# EAGLE design lora (EAGLE 6.5.0)
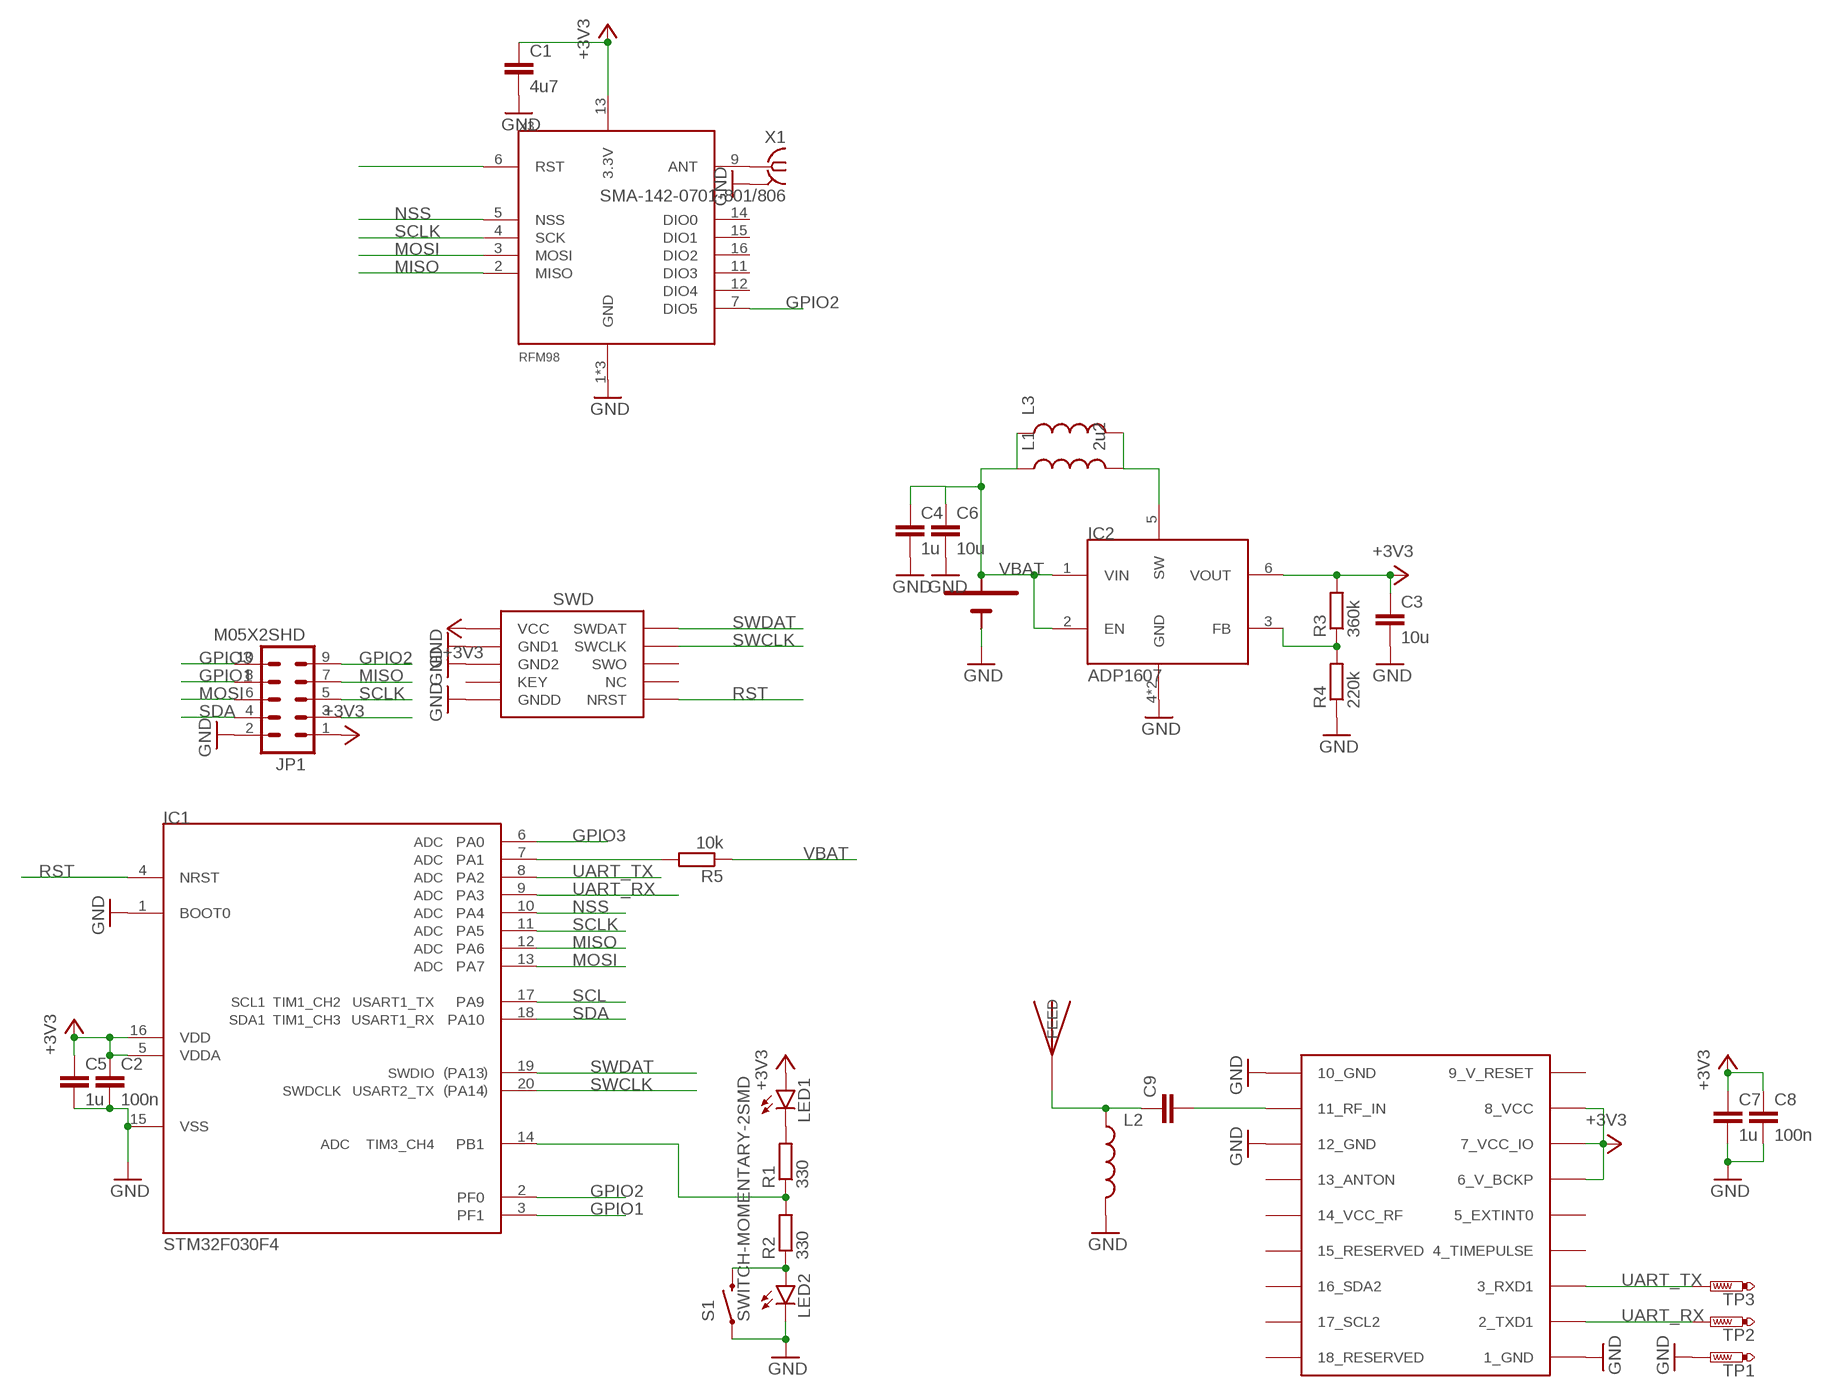
[diagram p0: schematic, sheet 1]

## Parts
C1  4u7  C-EUC0603  [C0603]
C2  100n  C-EUC0603  [C0603]
C3  10u  C-EUC0805  [C0805]
C4  1u  C-EUC0603  [C0603]
C5  1u  C-EUC0603  [C0603]
C6  10u  C-EUC0805  [C0805]
C7  1u  C-EUC0603  [C0603]
C8  100n  C-EUC0603  [C0603]
C9  C-EUC0603  [C0603]
IC1  STM32F030F4  [TSSOP20]
IC2  ADP1607  [LFCSP6]
J1  SWD_PTH_SHROUD  [SWD_PTH_SHROUD]
JP1  M05X2SHD  [2X5-SHROUDED]
L1  2u2  INDUCTOR0805  [0805]
L2  INDUCTOR0603  [0603]
L3  INDUCTOR1210  [1210]
LED1  LED0603  [LED-0603]
LED2  LED0603  [LED-0603]
R1  330  R-EU_R0603  [R0603]
R2  330  R-EU_R0603  [R0603]
R3  360k  R-EU_R0603  [R0603]
R4  220k  R-EU_R0603  [R0603]
R5  10k  R-EU_R0603  [R0603]
S1  SWITCH-MOMENTARY-2SMD  [TACTILE_SWITCH_SMD]
TP1  PTR1B1,27  [B1,27]
TP2  PTR1B1,27  [B1,27]
TP3  PTR1B1,27  [B1,27]
U$5  JTI_ANTENNA-1575AT43A40  [JTI_ANTENNA-1575AT43A40]
U$6  KEYSTONE-53  [KEYSTONE53]
X1  SMA-142-0701-801/806  [J502-ND-142-0701-801/806]
X2  UBLOX_MAX  [UBLOX_MAX]
X3  RFM98  [RFM97]

## Nets
+3V3: C1.1 C2.1 C3.1 C5.1 C7.1 C8.1 IC1.5(VDDA) IC1.16(VDD) IC2.6(VOUT) J1.1(VCC) JP1.1 LED1.A R3.2 X2.6_V_BCKP X2.7_VCC_IO X2.8_VCC X3.13(3.3V)
GND: C1.2 C2.2 C3.2 C4.2 C5.2 C6.2 C7.2 C8.2 IC1.1(BOOT0) IC1.15(VSS) IC2.4(GND) IC2.EP(GND) J1.3(GND1) J1.5(GND2) J1.9(GNDD) JP1.2 L2.2 LED2.C R4.1 S1.1 TP1.TP U$6.N1(-) U$6.N2(-) X1.G@1 X1.G@2 X1.G@3 X1.G@4 X2.1_GND X2.10_GND X2.12_GND X3.1(GND) X3.8(GND) X3.10(GND)
GPIO1: IC1.3(PF1) JP1.8
GPIO2: IC1.2(PF0) JP1.9 X3.7(DIO5)
GPIO3: IC1.6(PA0) JP1.10
MISO: IC1.12(PA6) JP1.7 X3.2(MISO)
MOSI: IC1.13(PA7) JP1.6 X3.3(MOSI)
N$1: C9.2 X2.11_RF_IN
N$2: X1.1 X3.9(ANT)
N$3: IC2.5(SW) L1.2 L3.2
N$4: C9.1 L2.1 U$5.FEED
N$5: LED2.A R2.1 S1.3
N$6: IC2.3(FB) R3.1 R4.2
N$7: LED1.C R1.2
N$8: IC1.14(PB1) R1.1 R2.2
N$9: IC1.7(PA1) R5.2
N$10: X3.6(RST)
NSS: IC1.10(PA4) X3.5(NSS)
RST: IC1.4(NRST) J1.10(NRST)
SCL: IC1.17(PA9) JP1.3
SCLK: IC1.11(PA5) JP1.5 X3.4(SCK)
SDA: IC1.18(PA10) JP1.4
SWCLK: IC1.20(PA14) J1.4(SWCLK)
SWDAT: IC1.19(PA13) J1.2(SWDAT)
UART_RX: IC1.9(PA3) TP2.TP X2.2_TXD1
UART_TX: IC1.8(PA2) TP3.TP X2.3_RXD1
VBAT: C4.1 C6.1 IC2.1(VIN) IC2.2(EN) L1.1 L3.1 R5.1 U$6.P1(+) U$6.P2(+)
Unconnected: J1.6(SWO) J1.7(KEY) J1.8(NC) X2.4_TIMEPULSE X2.5_EXTINT0 X2.13_ANTON X2.14_VCC_RF X2.15_RESERVED X2.16_SDA2 X2.17_SCL2 X2.18_RESERVED X3.11(DIO3) X3.12(DIO4) X3.14(DIO0) X3.15(DIO1) X3.16(DIO2)

## Power pins joined to a net without a drawn wire
9_V_RESET: X2.9_V_RESET

## Library data of the parts
C1-C9 = rcl:C-EU: CAPACITOR, European symbol
IC1 = dtb:STM32F030F4
IC2 = Mine:ADP1607
J1 = dtb:SWD_PTH_SHROUD
JP1 = SparkFun-Connectors:M05X2: Header 5x2 Standard 10-pin dual row 0.1" header. Commonly used with AVR-ISP. Use with Spark Fun Electronics SKU: PRT-00778
L1-L3 = SparkFun-Passives:INDUCTOR: Inductors Basic Inductor/Choke - 0603 and 1206. Footprints are not proven and vary greatly between part numbers. SRN6045- 33uH, 20% 1.4A SDR0403-560KL - 56uH, 10%, 500mA RMS/740mA peak
LED1 LED2 = SparkFun-LED:LED: LEDs Standard schematic elements and footprints for 5mm, 3mm, 1206, and 0603 sized LEDs. 5mm - Spark Fun Electronics SKU : COM-00529 (and others)
R1-R5 = rcl:R-EU_: RESISTOR, European symbol
S1 = Mine:SWITCH-MOMENTARY-2: Various NO switches- pushbuttons, reed, etc
TP1-TP3 = testpad:PTR1: TEST PIN
U$5 = Ava:JTI_ANTENNA-1575AT43A40
U$6 = Mine:KEYSTONE-53
X1 = con-coax:SMA-: SMA 50 Ohm End Launch Jack Receptacle - Round Contact Johnson Components Source: www.johnsoncomponents.com .. J502-ND.pdf; MF: JOHNSON COMPONENTS; MPN: 142-0701-801; OC_FARNELL: 1608592; OC_NEWARK: 90F2624
X2 = Ava:UBLOX_MAX: UBLOX MAX
X3 = Mine:RFM98

## Board
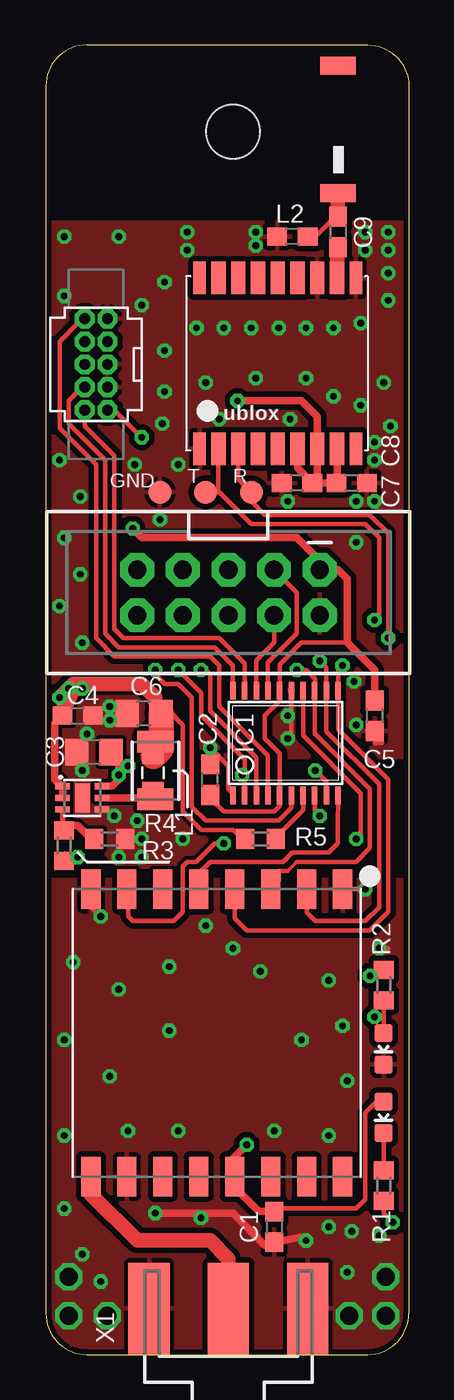
[diagram p1: board, top side]
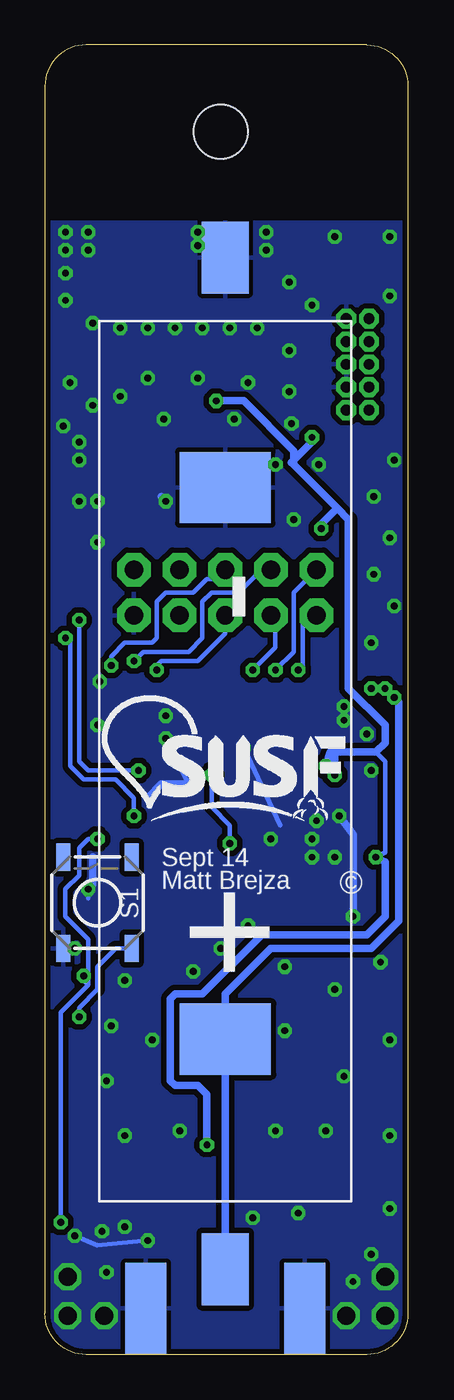
[diagram p2: board, bottom side, seen from below]

Size 20.19 x 72.9 mm. Coordinates in mm from the lower left corner, seen from the top.
Outline: 2.29,0 17.91,0 arc90 20.19,2.29 20.19,70.61 arc90 17.91,72.9 2.29,72.9 arc90 0,70.61 0,2.29 arc90 2.29,0
Copper layers (1*16): Top 0.035mm / dielectric 1.5mm / Bottom 0.035mm
Design rules "default *": minimum track width 8mil, minimum drill 15mil, track to track 8mil, track to pad 8mil, pad to pad 6mil, via to via 8mil, smd to smd 0mil, copper to edge 10mil, drill to drill 8mil, minimum pad ring 10mil, minimum via ring 8mil, stop-mask expansion 4mil, vias tented up to drill 15mil, thermal gap 10mil
Holes 3 mm at 10.41,68.07

### Footprints (pad centres in the part's own frame; a part is rotated, then mirrored left to right if it is on the bottom)
C0603 = smd 1.1 x 1: 1 -0.85,0; 2 0.85,0
C0805 = smd 1.3 x 1.5: 1 -0.95,0; 2 0.95,0
TSSOP20 = smd 0.305 x 0.991: 1 -2.925,-2.918; 2 -2.275,-2.918; 3 -1.625,-2.918; 4 -0.975,-2.918; 5 -0.325,-2.918; 6 0.325,-2.918; 7 0.975,-2.918; 8 1.625,-2.918; 9 2.275,-2.918; 10 2.925,-2.918; 11 2.925,2.918; 12 2.275,2.918; 13 1.625,2.918; 14 0.975,2.918; 15 0.325,2.918; 16 -0.325,2.918; 17 -0.975,2.918; 18 -1.625,2.918; 19 -2.275,2.918; 20 -2.925,2.918
LFCSP6 = smd 0.35 x 0.8: 1 -0.65,-1.1; 2 0,-1.1; 3 0.65,-1.1; 4 0.65,1.1; 5 0,1.1; 6 -0.65,1.1 | smd 1.6 x 0.8: EP 0,0
SWD_PTH_SHROUD = drill 0.6 octagon: 1 -2.54,-0.635; 2 -2.54,0.635; 3 -1.27,-0.635; 4 -1.27,0.635; 5 0,-0.635; 6 0,0.635; 7 1.27,-0.635; 8 1.27,0.635; 9 2.54,-0.635; 10 2.54,0.635
2X5-SHROUDED = drill 1.016 pad 1.88 octagon: 1 -1.27,5.08; 2 1.27,5.08; 3 -1.27,2.54; 4 1.27,2.54; 5 -1.27,0; 6 1.27,0; 7 -1.27,-2.54; 8 1.27,-2.54; 9 -1.27,-5.08; 10 1.27,-5.08
0805 = smd 0.8 x 1.2: 1 -0.9,0; 2 0.9,0
0603 = smd 1.1 x 1: 1 -0.85,0; 2 0.85,0
1210 = smd 1.2 x 2: 1 -1.6,0; 2 1.6,0
LED-0603 = smd 1 x 1: A 0,-0.877; C 0,0.877
R0603 = smd 1 x 1.1: 1 -0.85,0; 2 0.85,0
TACTILE_SWITCH_SMD = smd 1.524 x 0.762: 1 -2.54,1.905; 2 2.54,1.905; 3 -2.54,-1.905; 4 2.54,-1.905
B1,27 = smd 1.27 x 1.27: TP 0,0
JTI_ANTENNA-1575AT43A40 = smd 1 x 2: FEED -3.175,0; NC 3.925,0
KEYSTONE53 = smd 3.96 x 5.08: N1 14.73,0; P2 -15.97,0 | smd 4 x 2.6: N2 27.53,0; P1 -28.77,0
J502-ND-142-0701-801/806 = smd 5.08 x 2.286: 1 2.565,0; G@1 2.565,4.42; G@2 2.565,-4.42 | smd 5.08 x 2.286 bottom: G@3 2.565,4.42; G@4 2.565,-4.42
UBLOX_MAX = smd 1.8 x 0.7: 1_GND 4.95,-4.4; 9_V_RESET 4.95,4.3; 10_GND -4.55,4.3; 18_RESERVED -4.55,-4.4 | smd 1.8 x 0.8: 2_TXD1 4.95,-3.35; 3_RXD1 4.95,-2.25; 4_TIMEPULSE 4.95,-1.15; 5_EXTINT0 4.95,-0.05; 6_V_BCKP 4.95,1.05; 7_VCC_IO 4.95,2.15; 8_VCC 4.95,3.25; 11_RF_IN -4.55,3.25; 12_GND -4.55,2.15; 13_ANTON -4.55,1.05; 14_VCC_RF -4.55,-0.05; 15_RESERVED -4.55,-1.15; 16_SDA2 -4.55,-2.25; 17_SCL2 -4.55,-3.35
RFM97 = smd 2.184 x 1.067: 1 0,0; 2 0,-2; 3 0,-4; 4 0,-6; 5 0,-8; 6 0,-10; 7 0,-12; 8 0,-14; 9 16,-14; 10 16,-12; 11 16,-10; 12 16,-8; 13 16,-6; 14 16,-4; 15 16,-2; 16 16,0

### Placement (x,y rotation side)
C1  12.7,7.11 270 top
C2  9.14,32 90 top
C3  2.67,33.53 180 top
C4  1.78,35.56 0 top
C5  18.29,35.56 270 top
C6  5.46,35.69 180 top
C7  13.97,48.51 180 top
C8  17.02,48.51 0 top
C9  16.26,62.48 270 top
IC1  13.34,34.04 0 top
IC2  2.03,30.99 270 top
J1  2.79,55.12 90 top
JP1  10.16,42.42 270 top
L1  5.97,32.38 270 top
L2  13.72,62.23 180 top
L3  6.1,32.51 270 top
LED1  18.8,13.21 180 top
LED2  18.8,17.02 180 top
R1  18.8,9.4 90 top
R2  18.8,20.57 90 top
R3  1.02,28.32 270 top
R4  3.56,28.7 180 top
R5  11.94,28.7 0 top
S1  17.27,25.15 90 bottom
TP1  6.35,48.01 0 top
TP2  8.89,48.01 0 top
TP3  11.43,48.01 0 top
U$1  [SUSF-XSM]  17.02,29.72 0 bottom
U$5  16.26,67.82 90 top
U$6  10.16,33.53 90 bottom
X1  10.16,0 90 top
X2  12.95,55.37 270 top
X3  16.51,25.91 270 top

### Tracks (layer width: path | path; a pad name or v marks a point on that pad's centre or on a via)
+3V3  (via drill 0.38)
  Top 0.254: 16.17,50.39 X2.8_VCC | v5.33,51.05 3.81,52.58 J1.1 | C3.1 4.12,32.96 | R3.2 1.05,27.9 v1.78,27.69 | C5.1 18.45,36.41 | 16.76,39.62 14.22,39.62 13.01,38.41 IC1.16 13.01,36.38 12.19,35.56 12.19,34.29 13.01,33.47 IC1.5 13.01,30.54 12.7,30.23 9.91,30.23 9.65,30.48 9.4,30.65 C2.1 | LED1.A 18.4,14.08 17.78,13.46 17.78,8.64 17.27,8.13 12.87,8.13 C1.1
  Top 0.406: IC2.6 3.7,31.64 4.06,32 v4.06,32.26 4.06,33.47 C3.1 | v4.83,45.97 5.33,45.47 13.97,45.47 15.24,44.2 JP1.1 16.26,43.69 16.76,43.18 16.76,39.62 18.29,38.1 C5.1 | C1.1 11.85,7.96 10.67,9.14 10.67,9.75 X3.13 10.41,10 10.41,10.92 v11.18,11.68 | C8.1 16.2,48.55 X2.8_VCC 16.2,48.97 15.75,48.51 C7.1 | v10.67,53.09 14.22,53.09 15.1,52.21 X2.7_VCC_IO 15.1,48.8 C7.1 | X2.6_V_BCKP 14,49.33 C7.1
  Bottom 0.254: 1.78,33.53 1.27,33.02 1.27,27.94 v1.78,27.69
  Bottom 0.406: 3.94,47.12 3.3,46.48 3.3,37.08 1.27,35.05 1.27,34.04 1.78,33.53 4.06,33.53 | 3.94,47.12 6.35,49.53 | v5.33,51.05 5.33,50.8 6.48,49.66 6.35,49.53 | v4.83,45.97 4.83,46.23 3.94,47.12 | 4.06,33.53 4.32,33.53 v4.57,32.77 | v10.67,53.09 9.14,53.09 6.35,50.29 6.35,49.53 | v11.18,11.68 11.18,14.48 11.68,14.99 12.95,14.99 13.21,15.24 13.21,19.81 12.95,20.07 11.43,20.07 8.13,23.37 2.29,23.37 1.27,24.38 1.27,27.43 v1.78,27.69 | v4.06,32.26 4.06,33.53
GND  (via drill 0.38, 1)
  Top 0.254: C5.2 18.71,34.04 18.29,34.04 | X3.1 v17.78,25.91 | C2.2 v9.14,33.78 10.16,32.77 10.16,31.5 10.41,31.25 IC1.1 | X3.8 2.51,24.92 v3.05,24.38 | IC1.15 13.66,34.35 v13.46,34.29 | v18.54,22.61 19.05,22.61
  Top 0.406: 9.06,32.51 C2.2 | v14.48,6.35 14.14,6.52 C1.2 12.19,6.1 10.41,7.87 v6.1,7.87 | C7.2 13.12,48.68 | 4.57,9.4 4.57,9.85 X3.10
  Bottom 0.254: v17.78,25.91 17.78,25.4 | 12.19,31.75 v13.46,34.29 | 18.29,6.6 v18.54,6.6 17.27,6.1 v14.48,6.35 | 7.11,29.46 v9.14,33.78 | S1.1 v18.54,22.61
  Bottom 0.406: 12.19,31.75 13.72,31.75 14.48,30.99 | v17.78,25.91 17.53,26.16 17.53,27.69 | U$6.N2 10.16,59.69 | v13.46,47.5 13.72,47.75 | v3.05,24.38 3.05,28.96 v3.81,29.97
  other vias: 17.27,35.05 2.03,32.51 5.08,29.72 5.33,28.7 5.33,27.69 3.56,35.31 2.29,34.54 3.56,36.07 15.75,12.19 13.46,35.56 9.91,57.15 17.53,57.4 17.53,52.83 9.65,52.07 11.68,61.72 11.68,62.48 18.29,47.5 18.29,49.78 18.29,50.8 17.27,47.5 19.18,51.69 8.38,57.15 11.43,57.15 12.95,57.15 14.48,57.15 16,57.15 17.78,62.48 17.78,61.47 19.05,62.48 19.05,61.47 19.05,60.2 19.05,58.67 7.87,62.48 7.87,61.47 6.6,55.88 6.6,53.59 6.6,59.69 8.89,54.1 16,53.34 7.37,49.53 6.35,46.48 14.48,54.36 11.68,54.36 18.8,54.1 17.27,45.21 0.76,49.78 1.91,47.75 1.02,45.47 1.91,43.43 0.76,41.66 2.03,39.62 4.06,62.23 1.02,62.23 10.41,22.61 8.89,23.88 1.52,21.84 6.86,21.59 1.02,12.19 4.57,12.45 7.37,12.45 12.7,12.45 16.76,15.24 16.51,18.29 15.75,20.83 11.94,21.34 14.22,17.53 6.86,18.03 1.02,17.53 3.56,15.49 4.06,20.32 2.03,5.59 8.64,7.62 15.75,7.11 17.02,6.86 1.02,8.13 16.76,4.57 13.59,52.07 6.48,51.82 4.95,49.53 3.43,2.16 1.27,2.16 16.89,2.16 18.92,2.16 3.05,4.06 1.27,4.32 18.92,4.32 17.14,37.46 1.02,58.93 5.33,58.42 7.62,28.7 4.06,27.69
  pour Bottom (isolate 0.305): 0,62.99 21.84,62.99 21.84,0.25 -2.03,0.25 -2.03,12.45
  pour Top (isolate 0.305): -0.51,62.99 22.1,62.99 22.1,33.27 -0.76,33.27 -0.76,54.86
  pour Top (no thermals): 1.52,37.08 4.57,37.08 5.59,36.07 5.59,35.56 4.57,34.54 4.57,30.99 5.33,30.23 7.37,30.23 9.14,28.45 9.14,27.43 8.89,27.18 4.06,27.18 1.52,29.72 1.52,32 1.02,32.51 1.02,35.81
  pour Top (isolate 0.305): 0,26.42 20.07,26.42 21.08,25.4 21.08,-0.76 -2.03,-0.76 -2.54,-0.25
GPIO1  (via drill 0.38)
  Top 0.254: IC1.3 11.71,33.25 9.14,35.81 9.14,37.85 8.89,38.1 v8.64,38.1
  Bottom 0.254: v8.64,38.1 7.37,39.37 7.37,40.89 JP1.8
GPIO2  (via drill 0.38)
  Top 0.254: IC1.2 11.06,32.26 | 11.06,32.26 11.06,33.14 8.64,35.56 8.64,36.83 7.62,37.85 7.37,37.85 v7.37,38.1 | v9.91,28.45 9.4,28.45 8.38,27.43 7.87,27.43 7.62,27.18 7.62,24.64 7.11,24.13 4.83,24.13 4.57,24.38 4.57,25.85 X3.7 | v10.92,32.26 11.06,32.26
  Bottom 0.254: v7.37,38.1 6.35,39.12 6.35,42.42 JP1.9 | v9.91,28.45 9.91,29.46 10.92,30.48 v10.92,32.26
GPIO3  (via drill 0.38)
  Top 0.254: v6.1,38.1 6.1,37.85 6.6,37.34 7.37,37.34 8.13,36.58 8.13,30.48 8.89,29.72 12.95,29.72 13.66,30.42 IC1.6
  Bottom 0.254: 6.1,38.35 v6.1,38.1 5.84,38.35 5.84,40.64 5.33,41.15 JP1.10
MISO  (via drill 0.38)
  Top 0.254: v15.24,38.61 15.61,38.24 IC1.12 15.61,34.68 18.54,31.75 18.54,24.89 17.78,24.13 14.99,24.13 14.51,24.61 X3.2
  Bottom 0.254: v15.24,38.61 14.73,39.12 12.19,39.12 11.43,39.88 11.43,41.91 10.92,42.42 9.4,42.42 8.38,43.43 7.87,43.43 JP1.7
MOSI  (via drill 0.38)
  Top 0.203: 13.46,26.92 13.97,27.43
  Top 0.254: IC1.13 14.96,34.57 18.03,31.5 18.03,28.19 17.27,27.43 13.97,27.43 | 13.46,26.92 12.95,26.92 12.95,26.35 X3.3 12.26,25.65 | IC1.13 14.96,37.36 | v13.97,38.1 14.48,38.1 14.99,37.59 14.99,36.98 IC1.13
  Bottom 0.254: v13.97,38.1 13.97,38.35 13.72,38.61 11.68,38.61 10.16,40.13 JP1.6
N$1
  Top 0.813: X2.11_RF_IN 16.2,61.58 C9.2
N$2
  Top 0.813: X3.9 2.51,8.92 5.08,6.35 9.14,6.35 10.16,5.33 X1.1
N$3
  Top 0.406: IC2.5 5.45,30.99 L1.2
  Top 0.813: L3.2 6.1,31.36 L1.2
N$4
  Top 0.254: C9.1 16.09,63.33 14.99,62.23 L2.1
  Top 0.813: U$5.FEED C9.1
N$5  (via drill 0.38)
  Top 0.254: v18.29,18.8 18.8,18.8 | 18.8,18.8 R2.1 | LED2.A 18.8,18.8
  Bottom 0.254: S1.3 16.26,22.61 17.27,21.59 17.27,20.32 18.29,19.3 v18.29,18.8
N$6
  Top 0.305: IC2.3 0.93,29.25 R3.1
  Top 0.406: R4.2 2.54,28.7 1.78,29.46 1.31,29.46 R3.1
N$7
  Top 0.254: R1.2 LED1.C
N$8  (via drill 0.38)
  Top 0.254: IC1.14 14.31,34.46 17.53,31.24 17.53,28.96 v17.27,28.7 | 19.3,7.62 19.56,7.37 v19.3,7.37 18.8,7.87 R1.1 | R2.2 18.38,21.42 v18.03,21.08
  Bottom 0.254: v17.27,28.7 17.78,28.7 18.29,28.19 18.29,26.67 19.05,25.91 19.05,24.38 17.78,23.11 17.78,20.57 | 17.78,20.57 19.3,19.05 v19.3,7.37 | v18.03,21.08 18.03,20.83 17.78,20.57
N$9
  Top 0.254: R5.2 12.7,28.7 14.31,30.31 IC1.7
NSS
  Top 0.254: X3.5 8.51,26.8 9.14,27.43 13.21,27.43 13.72,27.94 15.75,27.94 16.26,28.45 16.26,29.34 IC1.10
RST
  Top 0.254: IC1.4 12.36,33.36 9.65,36.07 9.65,38.35 9.14,38.86 3.81,38.86 2.79,39.88 2.79,49.53 0.76,51.56 0.76,56.39 1.78,57.4 2.16,57.4 J1.10
SCL
  Top 0.254: IC1.17 12.36,38.52 13.97,40.13 13.97,42.42 JP1.3
SCLK  (via drill 0.38)
  Top 0.254: v16.51,38.35 16.26,38.1 IC1.11 16.26,34.79 19.05,32 19.05,24.64 18.03,23.62 11.18,23.62 10.51,24.29 X3.4
  Bottom 0.254: v16.51,38.35 16.51,38.86 15.75,39.62 14.22,39.62 13.97,39.88 13.97,41.91 13.46,42.42 11.94,42.42 11.18,43.18 10.67,43.18 JP1.5
SDA
  Top 0.254: IC1.18 11.71,38.63 12.7,39.62 JP1.4
SWCLK
  Top 0.254: IC1.20 10.41,38.36 9.4,39.37 4.06,39.37 3.3,40.13 3.3,49.78 1.27,51.82 1.27,53.09 2.03,53.85 J1.4
SWDAT
  Top 0.254: IC1.19 11.06,38.47 9.65,39.88 4.32,39.88 3.81,40.39 3.81,50.04 2.16,51.69 J1.2
UART_RX  (via drill 0.38)
  Top 0.254: v18.29,40.89 18.54,41.15 18.54,45.47 17.78,46.23 11.43,46.23 9.65,48.01 9.14,48.01 | TP2.TP 9.14,48.01 | X2.2_TXD1 9.6,48.05 9.14,48.01 | IC1.9 15.61,31.89 v14.99,32.51
  Bottom 0.254: v18.29,40.89 18.29,33.02 17.78,32.51 v14.99,32.51
UART_TX  (via drill 0.38)
  Top 0.254: v19.05,39.88 19.05,45.72 18.03,46.74 12.19,46.74 11.43,47.5 TP3.TP 10.7,48.73 X2.3_RXD1 | IC1.8 14.96,30.25 v15.24,29.97
  Bottom 0.254: v19.05,39.88 18.8,39.62 18.8,32.77 18.03,32 16.26,32 15.24,30.99 v15.24,29.97
VBAT  (via drill 0.38)
  Top 0.254: C6.1 6.03,35.81 6.86,35.81 7.62,35.05 7.62,30.23 8.64,29.21 10.41,29.21 10.92,28.7 R5.1
  Top 0.305: 1.02,35.65 1.1,35.65 1.14,35.69
  Top 0.406: IC2.2 IC2.1 0.87,31.64 0.51,32 0.51,35.14 C4.1 1.02,35.65 | 1.02,35.56 1.02,35.65 | 1.91,37.21 1.02,35.81 1.02,35.65 | 1.14,35.69 1.78,37.08 v2.03,37.08 | 6.1,36.32 6.1,36 C6.1 | v1.27,37.08 1.52,37.08
  Top 0.813: 6.1,36.32 6.1,36.58 5.33,37.34 2.29,37.34 | 2.29,37.34 v2.03,37.08 | v0.76,36.58 1.52,37.34 2.29,37.34 | 1.52,37.08 1.02,36.16 C4.1 | 1.78,37.08 1.79,37.08 1.81,37.06
  Top 1.422: C6.1 6.41,33.8 | L1.1 6.41,33.73 6.41,33.8 | 6.41,33.8 L3.1
  Bottom 0.406: v1.27,37.08 0.51,36.32 0.51,24.13 2.03,22.61 7.62,22.61 10.16,20.07 U$6.P2 U$6.P1

### Text on the board
tPlace: GND | T | R
bPlace: Sept 14 | Matt Brejza | ©